# Altium schematic sheet Power.SchDoc
size A4; SheetNumber: 2; SheetTotal: 5
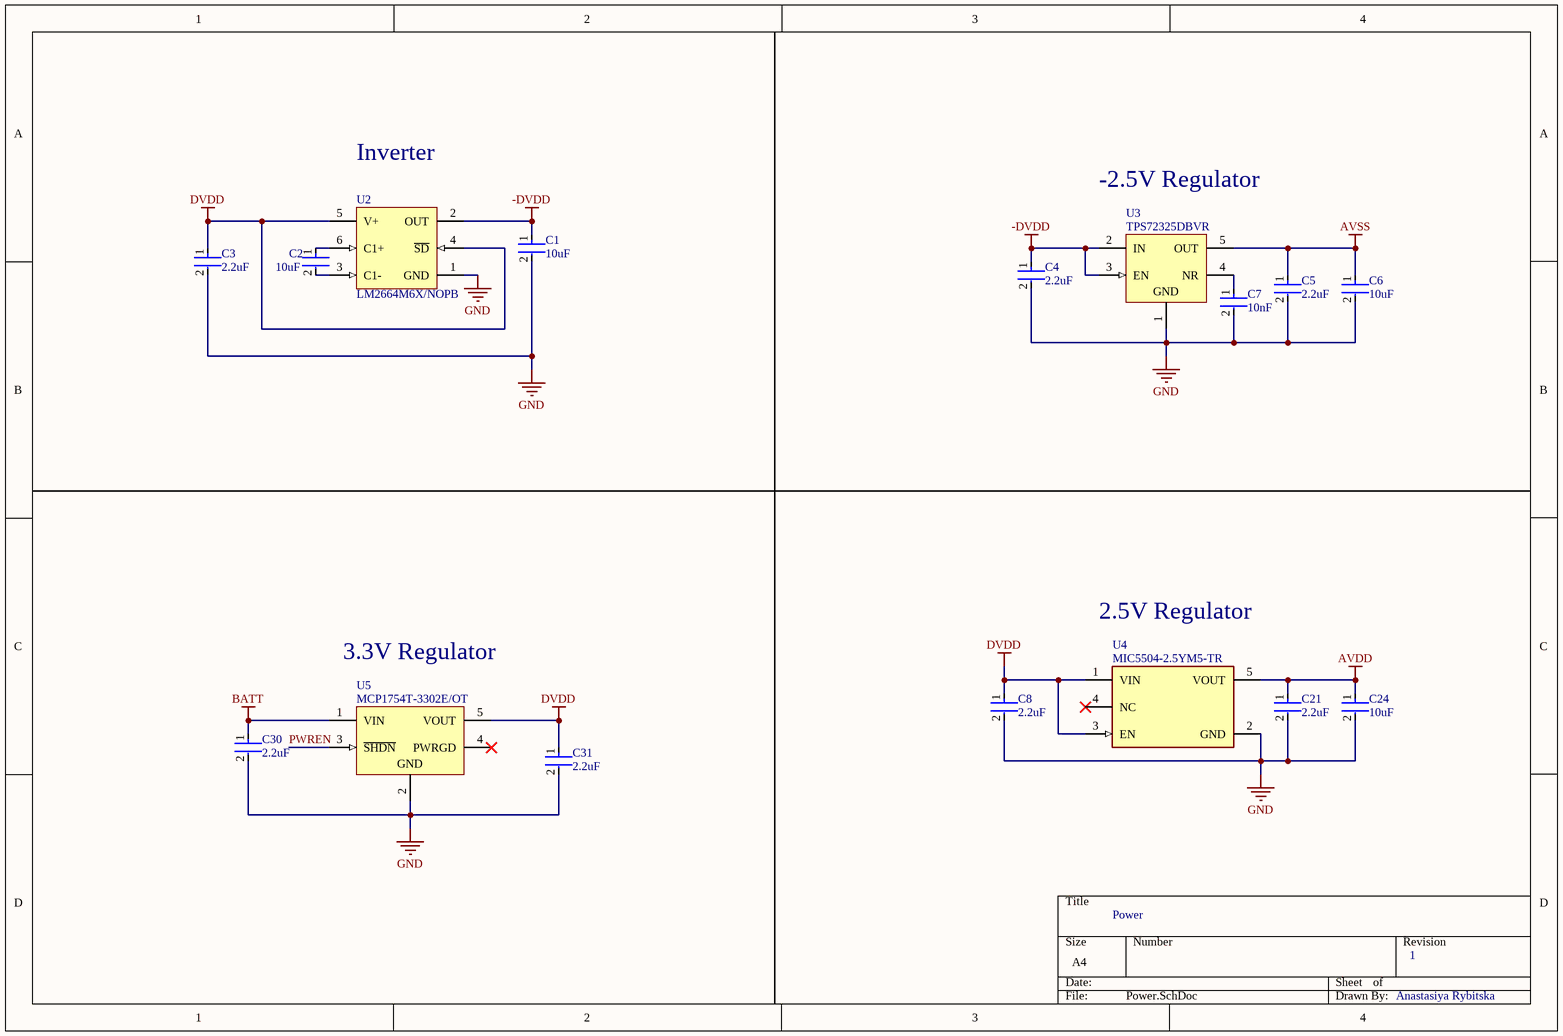
[diagram p0: Power.SchDoc]

## Parts
C1  Capacitance: 10uF  [FP-CL10-IPC_C]  (hidden comment: CL10A106MQ8NNNC)
C2  Capacitance: 10uF  [FP-CL10-IPC_C]  (hidden comment: CL10A106MQ8NNNC)
C3  Capacitance: 2.2uF  [FP-CL10-IPC_A]  (hidden comment: CL10A225KO8NNNC)
C4  Capacitance: 2.2uF  [FP-CL10-IPC_A]  (hidden comment: CL10A225KO8NNNC)
C5  Capacitance: 2.2uF  [FP-CL10-IPC_A]  (hidden comment: CL10A225KO8NNNC)
C6  Capacitance: 10uF  [FP-CL10-IPC_C]  (hidden comment: CL10A106MQ8NNNC)
C7  value 10nF  [FP-CC0603-DA-MFG]  (hidden comment: CC0603KRX7R9BB103)
C8  Capacitance: 2.2uF  [FP-CL10-IPC_A]  (hidden comment: CL10A225KO8NNNC)
C21  Capacitance: 2.2uF  [FP-CL10-IPC_A]  (hidden comment: CL10A225KO8NNNC)
C24  Capacitance: 10uF  [FP-CL10-IPC_C]  (hidden comment: CL10A106MQ8NNNC)
C30  Capacitance: 2.2uF  [FP-CL10-IPC_A]  (hidden comment: CL10A225KO8NNNC)
C31  Capacitance: 2.2uF  [FP-CL10-IPC_A]  (hidden comment: CL10A225KO8NNNC)
U2  LM2664M6X/NOPB  [DBV0006A_M]
U3  TPS72325DBVR  [DBV0005A_N]
U4  MIC5504-2.5YM5-TR  [FP-SOT23-5LD-PL-1-IPC_C]
U5  MCP1754T-3302E/OT  [MCHP-SOT-23-OT5_L]

## Nets
-DVDD: C1.1 C4.1 U2.2(OUT) U3.2(IN) U3.3(EN)
AVDD: C21.1 C24.1 U4.5(VOUT)
AVSS: C5.1 C6.1 U3.5(OUT)
BATT: C30.1 U5.1(VIN)
DVDD: C3.1 C8.1 C31.1 U2.4(~{SD}) U2.5(V+) U4.1(VIN) U4.3(EN) U5.5(VOUT)
GND: C1.2 C3.2 C4.2 C5.2 C6.2 C7.2 C8.2 C21.2 C24.2 C30.2 C31.2 U2.1(GND) U3.1(GND) U4.2(GND) U5.2(GND)
PWREN: U5.3(~{SHDN})
NetC2_1: C2.1 U2.6(C1+)
NetC2_2: C2.2 U2.3(C1-)
NetC7_1: C7.1 U3.4(NR)

Not connected (* = marked no-connect by the designer): U4 4(NC)*; U5 4(PWRGD)*

## Notes on the sheet
- Inverter
- -2.5V Regulator
- 2.5V Regulator
- 3.3V Regulator
- Power
- 1
- Anastasiya Rybitska

## Library data of the parts
C1 C2 C6 C24 = CMP-13271-001938-1: Cap Ceramic 10uF 6.3V X5R ±20% Pad SMD 0603 +85°C T/R; Contact Plating: Tin; Height: 0.8mm; Width: 0.031inch; Min Operating Temperature: -55°C; Dielectric: X5R; Voltage Rating: 6.3V; Case/Package: 0603; Package Quantity: 1; Radiation Hardening: No; Packaging: Tape and Reel; Max Operating Temperature: 85°C; Voltage: 6.3V; Thickness: 0.035inch; Mount: Surface Mount; Case Code (Imperial): 0603; Case Code (Metric): 1608; Depth: 0.8mm; Tolerance: 20%; Length: 1.6mm
C3-C5 C8 C21 C30 C31 = CMP-13271-000835-1: Cap Ceramic 2.2uF 16V X5R ±10% Pad SMD 0603 +85°C T/R; Case Code (Metric): 1608; Height: 0.8mm; Case/Package: 0603; Depth: 0.8mm; Voltage Rating: 16V; Case Code (Imperial): 0603; Length: 1.6mm; Packaging: Tape and Reel; Material: Ceramic; Lead Free: Lead Free; Max Operating Temperature: 85°C; Contact Plating: Tin; Thickness: 0.035inch; Radiation Hardening: No; Tolerance: 10%; Min Operating Temperature: -55°C; Voltage: 16V; Dielectric: X5R; Mount: Surface Mount; Package Quantity: 4000; Width: 0.031inch; Voltage Rating (DC): 16V
C7 = CMP-2100-03600-2: CAP CER 10000PF 50V X7R 0603; Manufacturer: YAGEO; Tolerance: 0.1; Material: Ceramic; Temperature Coefficient: 15%; Description: CC0603 10 nF X7R 10.00% 50 V; Capacitance: 10 nF; Mouser Description: Multilayer Ceramic Capacitor, CC Series, 0.01 - F, - 10%, X7R, 50 V, 0603 [1608 Metric]; Digikey Description: CAP CER 10000PF 50V X7R 0603; Height: 0.9mm; Category: Cap; Temperature Characteristic: X7R; Footprint Url: http://www.yageo.com/exep/pages/download/literatures/UPY-C_GEN_24.pdf; Lead Free: Yes; Voltage Rating: 50 V; Manufacturer Part Number: CC0603KRX7R9BB103; Temperature: -55°C to +125°C; Device Class L3: Ceramic Capacitors; ComponentLink2Description: Datasheet; Voltage: 50 V; Package: CC0603-DA; Octopart: https://octopart.com/cc0603krx7r9bb103-yageo-192938; Automotive: No; Temperature Range High: +125°C; Temperature Range Low: -55°C; RoHS: TRUE; Device Class L1: Passive Components; ComponentLink2URL: http://www.yageo.com/documents/recent/UPY-GPHC_X7R_6.3V-to-50V_18.pdf; Device Class L2: Capacitors
U2 = CMP-0065-00076-3: Switched Capacitor Voltage Converter, 6-pin SOT-23, Pb-Free; Manufacturer: Texas Instruments; CompType: Switch Caps; PackageTopMarking: S03A*XTT; PowerWise: N; PackageDescription: Molded SOT-23, .115 x .063 x .040in Body, 6 Lead, .0375in in Pitch; PinCount: 6; RoHS: Y; PackageReference: DBV0006A; ComponentLink1Description: Datasheet URL; Code_JEDEC: MO-178-AB; Code_IPC: SOT26A-6; ComponentLink1URL: http://www.ti.com/general/docs/lit/getliterature.tsp?genericPartNumber=LM2664&fileType=pdf
U3 = CMP-0394-00292-2: Single Output High PSRR LDO, 200 mA, Fixed -2.5 V Output, -10 to -2.7 V Input, 5-pin SOT-23 (DBV), -40 to 125 degC, Green (RoHS & no Sb/Br); Manufacturer: Texas Instruments; Iout(Max)(A): 0.2; Iq(Typ)(mA): 0.13; Accuracy(%): 2; Vdo(Typ)(mV): 280; SubFamily: Single Channel LDO; Vin(Max)(V): -2.7; PartNumber: TPS72325DBVR; PackageReference: DBV0005A; ComponentLink3Description: Package Specification; Fixed Output Options(V): -2.5; ComponentLink1URL: http://www.ti.com/; ComponentLink1Description: Manufacturer URL; Mounting Technology: Surface Mount; PackageDescription: 5-Pin Plastic Small Outline, Body 1.60 Ãƒâ€” 2.90 mm, Pitch 0.95 mm; ComponentLink2URL: http://www.ti.com/general/docs/lit/getliterature.tsp?genericPartNumber=TPS72325&fileType=pdf; PackageVersion: 4073253-4/K; ComponentLink3URL: http://www.ti.com/litv/pdf/mpds018i; Vout Adj(Min)(V): -2.5; ComponentLink2Description: Datasheet; Vout Adj(Max)(V): -2.5; Eco-Plan: Green (RoHS & no Sb/Br); DatasheetVersion: SLVS346B; Vin(Min)(V): -10; Code_JEDEC: MO-178
U4 = CMP-06324-000081-1: IC REG LINEAR 2.5V 300MA SOT23-5; Dropout Voltage: 160mV; Number of Regulators: 1; Min Current Limit: 400mA; Mount: Surface Mount; Output Current: 300mA; Min Operating Temperature: -40°C; Case/Package: SOT-23-5; Output Voltage: 2.5V; Packaging: Cut Tape; Max Operating Temperature: 125°C
U5 = CMP-0136-01150-1: 150 mA, 16 V, High Performance LDO, -40 to 125 degC, 5-pin SOT-23 (OT5), Tape and Reel; Manufacturer: Microchip; DatasheetVersion: Rev. A; ComponentLink3Description: Package Specification; ComponentLink4Description: Product URL; ComponentLink1URL: http://www.microchip.com; PackageReference: SOT-23-OT5; ComponentLink4URL: http://www.microchip.com/MCP1754; ComponentLink3URL: http://www.microchip.com/stellent/groups/techpub_sg/documents/packagingspec/en012702.pdf; ComponentLink1Description: Manufacturer URL; ComponentLink2URL: http://ww1.microchip.com/downloads/en/DeviceDoc/22276A.pdf; PackageDescription: 5-Lead Plastic Small Outline Transistor, 2.9 x 1.55 mm Body, 0.95 mm Pitch; PackageVersion: C04-091B; PartNumber: MCP1754T-3302E/OT; Mounting Technology: Surface Mount; ComponentLink2Description: Datasheet